# Altium schematic sheet FluidValves.SchDoc
size A
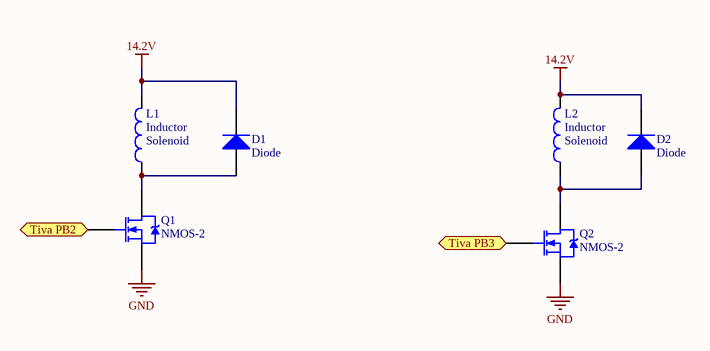
[diagram p0: FluidValves.SchDoc]

## Parts
D1  Diode  [DSO-C2/X3.3]
D2  Diode  [DSO-C2/X3.3]
L1  Inductor  value Solenoid  [C1005-0402]
L2  Inductor  value Solenoid  [C1005-0402]
Q1  NMOS-2  [SFM-T3/A4.7V]
Q2  NMOS-2  [SFM-T3/A4.7V]

## Ports
Tiva PB2, Tiva PB3

## Nets
14.2V: D1.2(K) D2.2(K) L1.2 L2.2
GND: Q1.3(S) Q2.3(S)
Tiva PB2: Q1.1(G) ; port Tiva PB2
Tiva PB3: Q2.1(G) ; port Tiva PB3
NetD1_1: D1.1(A) L1.1 Q1.2(D)
NetD2_1: D2.1(A) L2.1 Q2.2(D)

## Library data of the parts
D1 D2 = Diode: Default Diode; Manufacturer: Generic Components; Class: Discrete; SubClass: Diode - Switching; Published: 08/06/2000; Publisher: Altium Hobart Technology Centre
L1 L2 = Inductor: Manufacturer: Generic Components; Class: Passive; Published: 08/06/2000; Publisher: Altium Hobart Technology Centre; SubClass: Inductor
Q1 Q2 = NMOS-2: N-Channel Power MOSFET; Manufacturer: Generic Components; Class: Discrete; SubClass: MOSFET - Power; Note: Pin 2 is electrically connected to pin 4.; Published: 08/06/2000